# EAGLE board A500-EXT-IDE.v1.0.0 (EAGLE 9.0.0)
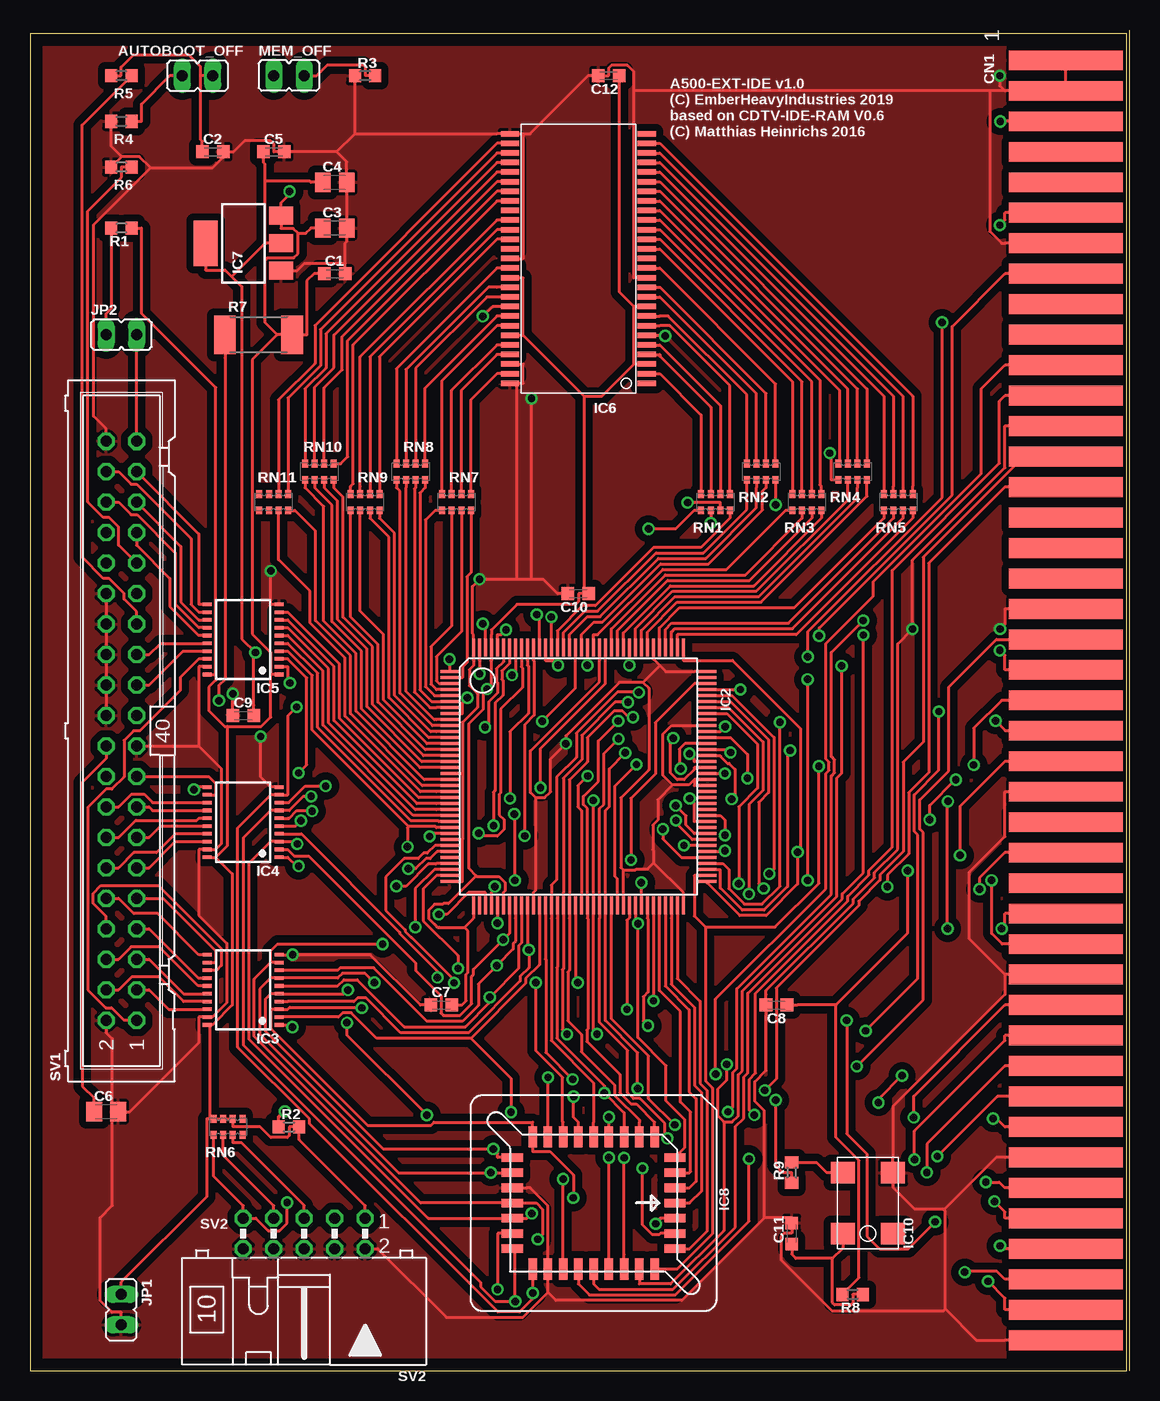
[diagram p2: board, top side]
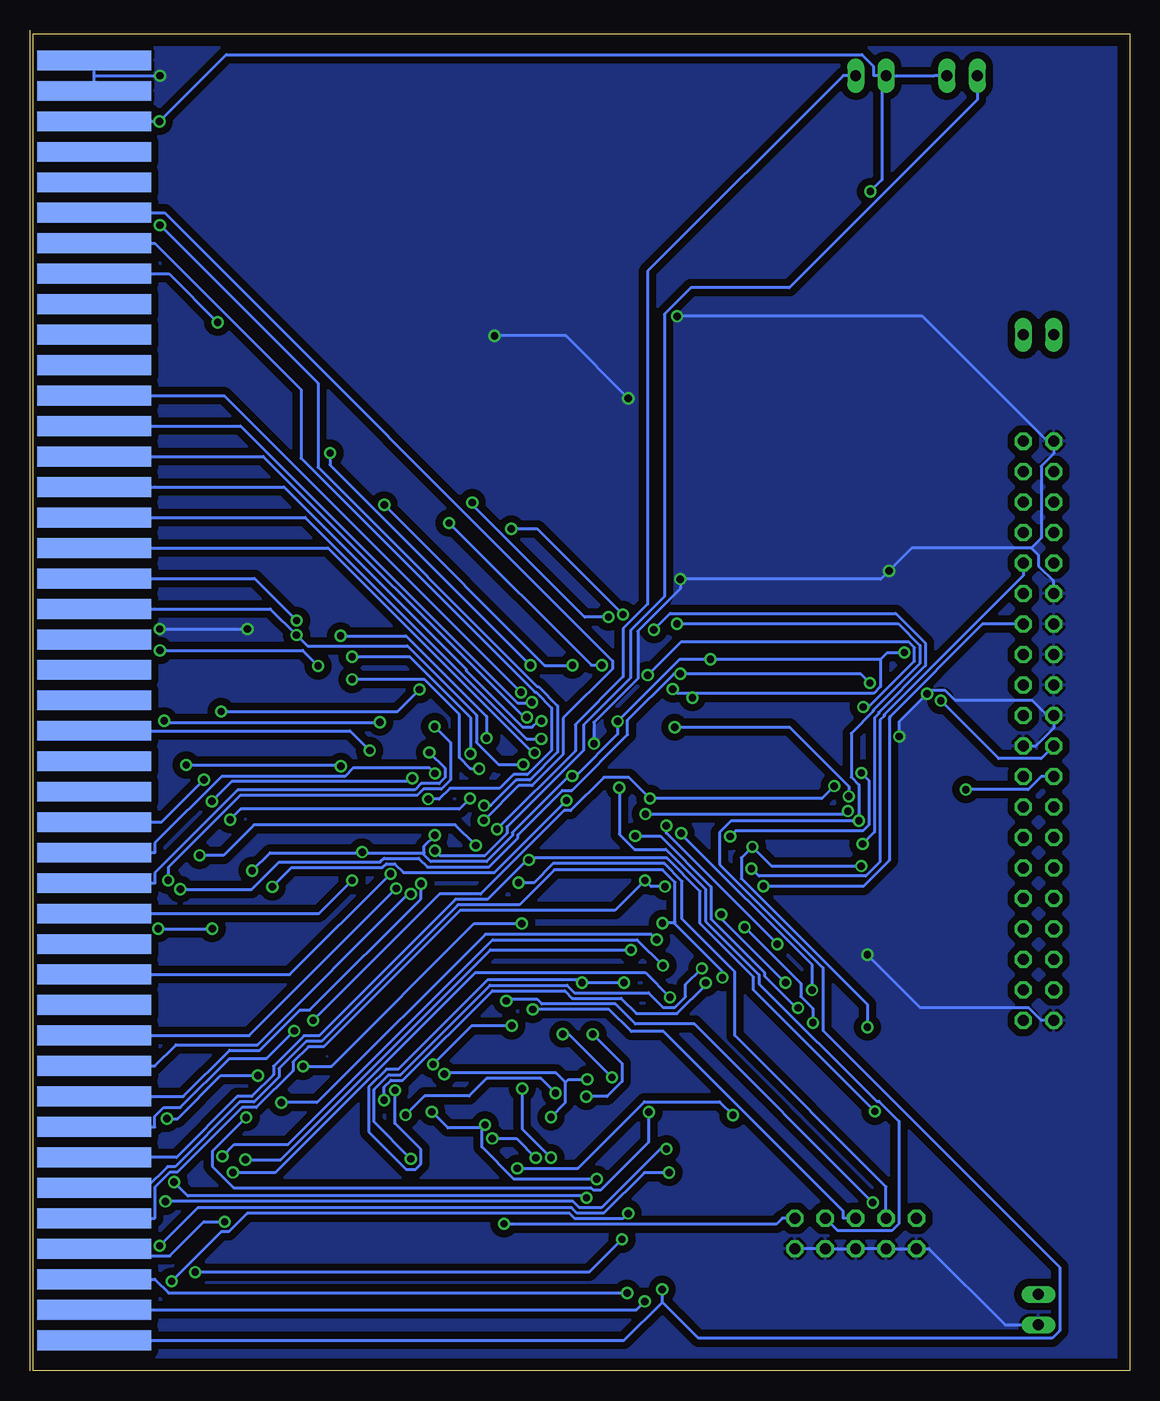
[diagram p3: board, bottom side, seen from below]

Size 91.42 x 111.43 mm. Coordinates in mm from the lower left corner, seen from the top.
Outline: 0,0 91.42,0 91.42,111.43 0,111.43 0,0
Copper layers (1*16): Top 0.035mm / dielectric 0.36mm / Bottom 0.035mm
Design rules "default *": minimum track width 10mil, minimum drill 24mil, track to track 8mil, track to pad 8mil, pad to pad 8mil, via to via 8mil, smd to smd 8mil, copper to edge 40mil, drill to drill 8mil, minimum pad ring 10mil, minimum via ring 8mil, stop-mask expansion 4mil, vias tented up to drill 0mil, thermal gap 10mil

## Footprints (pad centres in the part's own frame; a part is rotated, then mirrored left to right if it is on the bottom)
JP1 = drill 0.914 long: 1 0,-1.27; 2 0,1.27
C0603K = smd 1.05 x 1.08: 1 -0.875,0; 2 0.875,0
C0805K = smd 1.3 x 1.6: 1 -1,0; 2 1,0
LKONT_43-SLOT-SOLDER = smd 1.65 x 9.5: 1 -53.34,5.08; 3 -50.8,5.08; 5 -48.26,5.08; 7 -45.72,5.08; 9 -43.18,5.08; 11 -40.64,5.08; 13 -38.1,5.08; 15 -35.56,5.08; 17 -33.02,5.08; 19 -30.48,5.08; 21 -27.94,5.08; 23 -25.4,5.08; 25 -22.86,5.08; 27 -20.32,5.08; 29 -17.78,5.08; 31 -15.24,5.08; 33 -12.7,5.08; 35 -10.16,5.08; 37 -7.62,5.08; 39 -5.08,5.08; 41 -2.54,5.08; 43 0,5.08; 45 2.54,5.08; 47 5.08,5.08; 49 7.62,5.08; 51 10.16,5.08; 53 12.7,5.08; 55 15.24,5.08; 57 17.78,5.08; 59 20.32,5.08; 61 22.86,5.08; 63 25.4,5.08; 65 27.94,5.08; 67 30.48,5.08; 69 33.02,5.08; 71 35.56,5.08; 73 38.1,5.08; 75 40.64,5.08; 77 43.18,5.08; 79 45.72,5.08; 81 48.26,5.08; 83 50.8,5.08; 85 53.34,5.08 | smd 1.65 x 9.5 bottom: 2 -53.34,5.08; 4 -50.8,5.08; 6 -48.26,5.08; 8 -45.72,5.08; 10 -43.18,5.08; 12 -40.64,5.08; 14 -38.1,5.08; 16 -35.56,5.08; 18 -33.02,5.08; 20 -30.48,5.08; 22 -27.94,5.08; 24 -25.4,5.08; 26 -22.86,5.08; 28 -20.32,5.08; 30 -17.78,5.08; 32 -15.24,5.08; 34 -12.7,5.08; 36 -10.16,5.08; 38 -7.62,5.08; 40 -5.08,5.08; 42 -2.54,5.08; 44 0,5.08; 46 2.54,5.08; 48 5.08,5.08; 50 7.62,5.08; 52 10.16,5.08; 54 12.7,5.08; 56 15.24,5.08; 58 17.78,5.08; 60 20.32,5.08; 62 22.86,5.08; 64 25.4,5.08; 66 27.94,5.08; 68 30.48,5.08; 70 33.02,5.08; 72 35.56,5.08; 74 38.1,5.08; 76 40.64,5.08; 78 43.18,5.08; 80 45.72,5.08; 82 48.26,5.08; 84 50.8,5.08; 86 53.34,5.08
TQFP144 = smd 0.27 x 1.5: 1 -8.75,-10.75; 2 -8.25,-10.75; 3 -7.75,-10.75; 4 -7.25,-10.75; 5 -6.75,-10.75; 6 -6.25,-10.75; 7 -5.75,-10.75; 8 -5.25,-10.75; 9 -4.75,-10.75; 10 -4.25,-10.75; 11 -3.75,-10.75; 12 -3.25,-10.75; 13 -2.75,-10.75; 14 -2.25,-10.75; 15 -1.75,-10.75; 16 -1.25,-10.75; 17 -0.75,-10.75; 18 -0.25,-10.75; 19 0.25,-10.75; 20 0.75,-10.75; 21 1.25,-10.75; 22 1.75,-10.75; 23 2.25,-10.75; 24 2.75,-10.75; 25 3.25,-10.75; 26 3.75,-10.75; 27 4.25,-10.75; 28 4.75,-10.75; 29 5.25,-10.75; 30 5.75,-10.75; 31 6.25,-10.75; 32 6.75,-10.75; 33 7.25,-10.75; 34 7.75,-10.75; 35 8.25,-10.75; 36 8.75,-10.75; 73 8.75,10.75; 74 8.25,10.75; 75 7.75,10.75; 76 7.25,10.75; 77 6.75,10.75; 78 6.25,10.75; 79 5.75,10.75; 80 5.25,10.75; 81 4.75,10.75; 82 4.25,10.75; 83 3.75,10.75; 84 3.25,10.75; 85 2.75,10.75; 86 2.25,10.75; 87 1.75,10.75; 88 1.25,10.75; 89 0.75,10.75; 90 0.25,10.75; 91 -0.25,10.75; 92 -0.75,10.75; 93 -1.25,10.75; 94 -1.75,10.75; 95 -2.25,10.75; 96 -2.75,10.75; 97 -3.25,10.75; 98 -3.75,10.75; 99 -4.25,10.75; 100 -4.75,10.75; 101 -5.25,10.75; 102 -5.75,10.75; 103 -6.25,10.75; 104 -6.75,10.75; 105 -7.25,10.75; 106 -7.75,10.75; 107 -8.25,10.75; 108 -8.75,10.75 | smd 1.5 x 0.27: 37 10.75,-8.75; 38 10.75,-8.25; 39 10.75,-7.75; 40 10.75,-7.25; 41 10.75,-6.75; 42 10.75,-6.25; 43 10.75,-5.75; 44 10.75,-5.25; 45 10.75,-4.75; 46 10.75,-4.25; 47 10.75,-3.75; 48 10.75,-3.25; 49 10.75,-2.75; 50 10.75,-2.25; 51 10.75,-1.75; 52 10.75,-1.25; 53 10.75,-0.75; 54 10.75,-0.25; 55 10.75,0.25; 56 10.75,0.75; 57 10.75,1.25; 58 10.75,1.75; 59 10.75,2.25; 60 10.75,2.75; 61 10.75,3.25; 62 10.75,3.75; 63 10.75,4.25; 64 10.75,4.75; 65 10.75,5.25; 66 10.75,5.75; 67 10.75,6.25; 68 10.75,6.75; 69 10.75,7.25; 70 10.75,7.75; 71 10.75,8.25; 72 10.75,8.75; 109 -10.75,8.75; 110 -10.75,8.25; 111 -10.75,7.75; 112 -10.75,7.25; 113 -10.75,6.75; 114 -10.75,6.25; 115 -10.75,5.75; 116 -10.75,5.25; 117 -10.75,4.75; 118 -10.75,4.25; 119 -10.75,3.75; 120 -10.75,3.25; 121 -10.75,2.75; 122 -10.75,2.25; 123 -10.75,1.75; 124 -10.75,1.25; 125 -10.75,0.75; 126 -10.75,0.25; 127 -10.75,-0.25; 128 -10.75,-0.75; 129 -10.75,-1.25; 130 -10.75,-1.75; 131 -10.75,-2.25; 132 -10.75,-2.75; 133 -10.75,-3.25; 134 -10.75,-3.75; 135 -10.75,-4.25; 136 -10.75,-4.75; 137 -10.75,-5.25; 138 -10.75,-5.75; 139 -10.75,-6.25; 140 -10.75,-6.75; 141 -10.75,-7.25; 142 -10.75,-7.75; 143 -10.75,-8.25; 144 -10.75,-8.75
TSSOP20 = smd 0.3 x 0.75: 1 -2.925,-3; 2 -2.275,-3; 3 -1.625,-3; 4 -0.975,-3; 5 -0.325,-3; 6 0.325,-3; 7 0.975,-3; 8 1.625,-3; 9 2.275,-3; 10 2.925,-3; 11 2.925,3; 12 2.275,3; 13 1.625,3; 14 0.975,3; 15 0.325,3; 16 -0.325,3; 17 -0.975,3; 18 -1.625,3; 19 -2.275,3; 20 -2.925,3
TSOP-2_54 = smd 1.51 x 0.458: P$1 -5.7,10.4; P$2 -5.7,9.6; P$3 -5.7,8.8; P$4 -5.7,8; P$5 -5.7,7.2; P$6 -5.7,6.4; P$7 -5.7,5.6; P$8 -5.7,4.8; P$9 -5.7,4; P$10 -5.7,3.2; P$11 -5.7,2.4; P$12 -5.7,1.6; P$13 -5.7,0.8; P$14 -5.7,0; P$15 -5.7,-0.8; P$16 -5.7,-1.6; P$17 -5.7,-2.4; P$18 -5.7,-3.2; P$19 -5.7,-4; P$20 -5.7,-4.8; P$21 -5.7,-5.6; P$22 -5.7,-6.4; P$23 -5.7,-7.2; P$24 -5.7,-8; P$25 -5.7,-8.8; P$26 -5.7,-9.6; P$27 -5.7,-10.4; P$28 5.7,-10.4; P$29 5.7,-9.6; P$30 5.7,-8.8; P$31 5.7,-8; P$32 5.7,-7.2; P$33 5.7,-6.4; P$34 5.7,-5.6; P$35 5.7,-4.8; P$36 5.7,-4; P$37 5.7,-3.2; P$38 5.7,-2.4; P$39 5.7,-1.6; P$40 5.7,-0.8; P$41 5.7,0; P$42 5.7,0.8; P$43 5.7,1.6; P$44 5.7,2.4; P$45 5.7,3.2; P$46 5.7,4; P$47 5.7,4.8; P$48 5.7,5.6; P$49 5.7,6.4; P$50 5.7,7.2; P$51 5.7,8; P$52 5.7,8.8; P$53 5.7,9.6; P$54 5.7,10.4
SOT223 = smd 1.5 x 2: 1 -2.3,-3.15; 2 0,-3.15; 3 2.3,-3.15 | smd 3.8 x 2: 4 0,3.15
PLCC-32-SMT-TT = smd 0.71 x 1.78: 1 0,6.785; 2 -1.27,6.785; 3 -2.54,6.785; 4 -3.81,6.785; 14 -3.81,-6.785; 15 -2.54,-6.785; 16 -1.27,-6.785; 17 0,-6.785; 18 1.27,-6.785; 19 2.54,-6.785; 20 3.81,-6.785; 30 3.81,6.785; 31 2.54,6.785; 32 1.27,6.785 | smd 1.78 x 0.71: 5 -5.515,5.08; 6 -5.515,3.81; 7 -5.515,2.54; 8 -5.515,1.27; 9 -5.515,0; 10 -5.515,-1.27; 11 -5.515,-2.54; 12 -5.515,-3.81; 13 -5.515,-5.08; 21 5.515,-5.08; 22 5.515,-3.81; 23 5.515,-2.54; 24 5.515,-1.27; 25 5.515,0; 26 5.515,1.27; 27 5.515,2.54; 28 5.515,3.81; 29 5.515,5.08
7X5 = smd 1.8 x 2: P$1 -2.54,-2.1; P$2 2.54,-2.1; P$3 2.54,2.1; P$4 -2.54,2.1
R0603 = smd 1 x 1.1: 1 -0.85,0; 2 0.85,0
R2512 = smd 1.8 x 3.2: 1 -2.8,0; 2 2.8,0
CAY16 = smd 0.5 x 0.65: 1 -1.2,-0.675; 2 -0.4,-0.675; 3 0.4,-0.675; 4 1.2,-0.675; 5 1.2,0.675; 6 0.4,0.675; 7 -0.4,0.675; 8 -1.2,0.675
ML40 = drill 0.914 octagon: 1 -24.13,-1.27; 2 -24.13,1.27; 3 -21.59,-1.27; 4 -21.59,1.27; 5 -19.05,-1.27; 6 -19.05,1.27; 7 -16.51,-1.27; 8 -16.51,1.27; 9 -13.97,-1.27; 10 -13.97,1.27; 11 -11.43,-1.27; 12 -11.43,1.27; 13 -8.89,-1.27; 14 -8.89,1.27; 15 -6.35,-1.27; 16 -6.35,1.27; 17 -3.81,-1.27; 18 -3.81,1.27; 19 -1.27,-1.27; 20 -1.27,1.27; 21 1.27,-1.27; 22 1.27,1.27; 23 3.81,-1.27; 24 3.81,1.27; 25 6.35,-1.27; 26 6.35,1.27; 27 8.89,-1.27; 28 8.89,1.27; 29 11.43,-1.27; 30 11.43,1.27; 31 13.97,-1.27; 32 13.97,1.27; 33 16.51,-1.27; 34 16.51,1.27; 35 19.05,-1.27; 36 19.05,1.27; 37 21.59,-1.27; 38 21.59,1.27; 39 24.13,-1.27; 40 24.13,1.27
ML10L = drill 0.914 octagon: 1 -5.08,-1.27; 2 -5.08,1.27; 3 -2.54,-1.27; 4 -2.54,1.27; 5 0,-1.27; 6 0,1.27; 7 2.54,-1.27; 8 2.54,1.27; 9 5.08,-1.27; 10 5.08,1.27

## Placement (x,y rotation side)
AUTOBOOT_OFF  [JP1]  13.97,107.95 90 top
C1  100n  [C0603K]  25.4,91.44 0 top
C2  100n  [C0603K]  15.24,101.6 0 top
C3  10u  [C0805K]  25.4,95.25 0 top
C4  10u  [C0805K]  25.4,99.06 0 top
C5  100n  [C0603K]  20.32,101.6 0 top
C6  10u  [C0805K]  6.35,21.59 0 top
C7  100n  [C0603K]  34.29,30.48 0 top
C8  100n  [C0603K]  62.23,30.48 180 top
C9  100n  [C0603K]  17.78,54.61 0 top
C10  100n  [C0603K]  45.72,64.77 180 top
C11  100n  [C0603K]  63.5,11.43 90 top
C12  100n  [C0603K]  48.26,107.95 180 top
CN1  A500-EXPANSION-SLOT-SOLDER  [LKONT_43-SLOT-SOLDER]  81.28,55.88 270 top
IC2  XC95288XL-TQ144  [TQFP144]  45.72,49.53 270 top
IC3  74HCT245PW  [TSSOP20]  17.78,31.75 90 top
IC4  74HCT245PW  [TSSOP20]  17.78,45.72 90 top
IC5  74HCT245PW  [TSSOP20]  17.78,60.96 90 top
IC6  AS4C4M16S-6TCN  [TSOP-2_54]  45.72,92.71 180 top
IC7  LD117AS33TR  [SOT223]  17.78,93.98 90 top
IC8  AM29F010J-SOCKET  [PLCC-32-SMT-TT]  46.99,13.97 270 top
IC10  50MHz  [7X5]  69.85,13.97 90 top
JP1  [JP1]  7.62,5.08 180 top
JP2  [JP1]  7.62,86.36 270 top
MEM_OFF  [JP1]  21.59,107.95 270 top
R1  330  [R0603]  7.62,95.25 180 top
R2  4.7k  [R0603]  21.59,20.32 0 top
R3  4.7k  [R0603]  27.94,107.95 0 top
R4  4.7k  [R0603]  7.62,104.14 0 top
R5  4.7k  [R0603]  7.62,107.95 0 top
R6  4.7k  [R0603]  7.62,100.33 0 top
R7  750mA  [R2512]  19.05,86.36 0 top
R8  FERRITE  [R0603]  68.58,6.35 180 top
R9  47  [R0603]  63.5,16.51 90 top
RN1  33  [CAY16]  57.15,72.39 0 top
RN2  33  [CAY16]  60.96,74.93 0 top
RN3  33  [CAY16]  64.77,72.39 0 top
RN4  33  [CAY16]  68.58,74.93 0 top
RN5  33  [CAY16]  72.39,72.39 0 top
RN6  4.7k  [CAY16]  16.51,20.32 0 top
RN7  33  [CAY16]  35.56,72.39 180 top
RN8  33  [CAY16]  31.75,74.93 180 top
RN9  33  [CAY16]  27.94,72.39 180 top
RN10  33  [CAY16]  24.13,74.93 180 top
RN11  33  [CAY16]  20.32,72.39 180 top
SV1  [ML40]  7.62,53.34 90 top
SV2  [ML10L]  22.86,11.43 180 top

## Tracks (layer width: path | path; a pad name or v marks a point on that pad's centre or on a via)
!BERR  (via drill 0.61 pad 1.02)
  Top 0.254: v63.37,51.7 63.16,51.49 63.16,40.36 61.19,38.39 59.39,38.39 57.55,40.23 57.55,41.78 IC2.75
  Bottom 0.254: CN1.46 65.01,53.34 v63.37,51.7
!BGACK  (via drill 0.61 pad 1.02)
  Top 0.254: IC2.104 58.53,56.28 62.03,52.79 62.03,41.81 v61.63,41.42
  Bottom 0.254: CN1.62 70.03,33.02 v61.63,41.42
!C1  (via drill 0.61 pad 1.02)
  Top 0.254: v64.84,59.52 64.84,61.6 76.04,72.8 v76.04,87.38 | IC2.93 55.39,50.78 55.39,51.01 v54.98,51.43
  Bottom 0.254: v64.84,59.52 60.03,59.52 54.98,54.46 v54.98,51.43 | v76.04,87.38 80.1,91.44 81.28,91.44 CN1.16
!C3  (via drill 0.61 pad 1.02)
  Top 0.254: IC2.94 57.55,51.28 57.55,51.21 58.14,50.62 58.28,50.62 58.78,50.12 58.78,47.93 v58.5,47.65
  Bottom 0.254: v58.5,47.65 57.59,47.65 56.69,48.54 52.55,48.54 51.4,49.69 50.22,49.69 48.2,51.71 48.2,55.26 49.5,56.56 49.59,56.56 69.1,76.07 69.1,81.8 81.28,93.98 CN1.14
!CAS
  Top 0.254: IC2.120 48.97,61.69 53.16,65.88 59.99,65.88 65.17,71.06 RN3.3
!CFIN  (via drill 0.61 pad 1.02)
  Top 0.254: IC2.80 55.23,44.28 53.86,45.65 v53.86,45.87
  Bottom 0.254: CN1.12 80.48,96.52 43.13,59.17 43.13,58.5 47.24,54.39 47.24,51.37 49.84,48.78 50.95,48.78 v53.86,45.87
!CFOUT  (via drill 0.61 pad 1.02)
  Top 0.254: v53.83,47.1 54.7,46.24 54.7,45.47 55.39,44.78 IC2.81 | CN1.11 81.28,96.52 81.28,95.91 v80.86,95.48
  Bottom 0.254: v80.86,95.48 67.69,82.32 67.69,75.31 49.41,57.02 49.31,57.02 47.7,55.41 47.7,51.56 50.03,49.23 51.15,49.23 53.28,47.1 v53.83,47.1
!DTACK  (via drill 0.61 pad 1.02)
  Top 0.254: v61.16,40.2 60.76,40.6 60.76,47.38 61.57,48.19 61.57,52.6 58.39,55.78 57.55,55.78 IC2.103
  Bottom 0.254: v61.16,40.2 73.42,27.94 81.28,27.94 CN1.66
!IDE_ACT
  Top 0.254: SV1.39 JP2.2
!IDE_R
  Top 0.254: SV1.25 9.93,59.69 10.88,60.63 IC5.16
!IDE_W
  Top 0.254: SV1.23 9.93,57.15 12.77,59.98 IC5.17
!LDS  (via drill 0.61 pad 1.02)
  Top 0.254: IC2.101 58.09,54.78 60.66,52.22 60.66,48.57 59.09,47 v59.09,40.6
  Bottom 0.254: CN1.70 78.91,22.86 75.07,26.71 72.54,26.71 69.19,30.05 | 69.19,30.05 | 69.19,30.05 68.37,30.05 59.09,39.33 v59.09,40.6
!MEM_CS  (via drill 0.61 pad 1.02)
  Top 0.254: v49.97,58.8 IC2.118 | v66.67,76.49 66.8,76.36 66.8,74.25 RN4.1
  Bottom 0.254: v66.67,76.49 66.67,75.5 v49.97,58.8
!MEM_WE
  Top 0.254: IC2.121 48.47,61.84 52.97,66.34 59.65,66.34 64.37,71.06 RN3.2
!RAS
  Top 0.254: IC2.119 49.47,61.51 53.39,65.43 60.34,65.43 65.97,71.06 RN3.4
!RESET  (via drill 0.61 pad 1.02)
  Top 0.254: v37.48,58.09 v37.47,58.09 37.47,59.2 IC2.143 | v79.16,40.13 79.16,41.06 81.28,43.18 CN1.53 | v21.67,57.32 21.48,57.51 21.48,58.69 IC5.2
  Bottom 0.254: v79.16,40.13 73.2,40.13 70.94,42.39 62.49,42.39 62.17,42.71 59.3,42.71 58.56,41.98 53.44,41.98 51.01,44.41 51.01,44.67 47.32,48.37 46.52,48.37 41.87,53.02 41.87,54.24 38.02,58.09 v37.48,58.09 22.44,58.09 v21.67,57.32
!UDS  (via drill 0.61 pad 1.02)
  Top 0.254: v69.67,28.33 74.02,32.68 74.02,44.66 73.71,44.96 73.71,48 75.76,50.05 v75.76,54.94 | IC2.105 v59.23,56.78
  Bottom 0.254: v69.67,28.33 71.97,26.02 75.07,26.02 79.15,21.93 80.55,21.93 81.28,21.2 81.28,20.32 CN1.72 | v75.76,54.94 61.06,54.94 v59.23,56.78
+3V3  (via drill 0.61 pad 1.02)
  Top 0.254: IC2.109 54.47,59.2 58.56,59.2 64.24,53.52 64.24,43.48 v64,43.23 64,40.55 61.38,37.94 59.19,37.94 56.47,40.65 IC2.73 | 67.19,30.48 73.18,36.47 v73.18,41.68 | R8.2 69.12,7.74 69.12,17.51 67.19,19.44 67.19,30.48 | 67.19,30.48 63.96,30.48 C8.1 | v57.94,44.63 57.94,45.89 57.55,46.28 IC2.84 | v46.49,49.58 45.67,48.76 45.67,46.99 45.97,46.7 IC2.55 | 37.2,41.26 34.88,38.94 34.47,38.94 34.41,38.88 33.73,38.88 33.23,38.38 33.23,37.69 33.73,37.2 33.76,37.2 33.99,36.97 34.12,36.97 34.14,36.94 36.21,36.94 | IC2.42 39.47,39.86 39.59,39.98 39.59,40.7 39.1,41.19 37.26,41.19 37.2,41.26 | 36.21,36.94 36.52,36.64 36.52,33.19 36.37,33.04 36.37,30.83 36.02,30.48 C7.2 | 37.2,41.26 36.57,41.89 36.57,53.91 37.77,55.11 37.77,56.48 v38.1,56.81 38.44,57.15 38.44,59.16 38.47,59.2 IC2.141 38.47,60.82 38.47,61.36 38.47,61.76 40.59,63.88 45.49,63.88 45.74,64.13 45.74,64.77 46.17,64.77 | 46.17,81.25 46.17,64.77 | 41.1,86.31 46.17,81.25 | 46.17,81.25 47.67,81.25 50.34,83.91 | 41.1,86.31 40.99,86.31 IC6.P$49 | IC6.P$43 41.1,91.11 41.1,86.31 | 50.34,83.91 50.34,88.71 | 50.34,83.91 50.45,83.91 IC6.P$3 | C10.1 46.17,64.77 | v42.7,54.12 45.47,56.89 IC2.127 | 50.34,88.71 49.13,89.91 C12.1 | v36.46,56.09 36.05,55.68 36.05,54.78 IC2.8 | 36.21,36.94 36.97,37.7 IC2.37 | v34.97,59.3 IC2.1 | 16.82,91.2 17.65,90.37 17.65,61.01 v18.8,59.86 18.66,59.72 18.66,55.48 C9.2 | 19.6,99.16 19.6,100.58 19.45,100.73 C5.1 | 19.6,93.98 19.6,99.16 | 19.6,99.16 23.32,99.16 23.42,99.06 C4.1 | 16.82,91.2 16.27,91.75 14.63,91.75 IC7.4 | 16.82,91.2 19.6,93.98 | 19.6,93.98 19.71,93.98 IC7.2 | IC6.P$9 50.34,88.71
  Bottom 0.254: 58.82,43.17 58.82,43.76 v57.94,44.63 | 58.82,43.17 58.82,42.98 58.28,42.44 53.63,42.44 51.47,44.6 51.47,44.86 46.75,49.58 v46.49,49.58 46.18,49.58 42.7,53.06 v42.7,54.12 37.53,59.3 v34.97,59.3 20.79,59.3 | 64,43.17 58.82,43.17 | v73.18,41.68 71.69,43.17 64,43.17 | 64,43.17 v64,43.23 | 36.46,56.46 37.75,56.46 v38.1,56.81 | 36.46,56.46 v36.46,56.09 | 20.79,59.3 20.79,57.02 21.34,56.46 36.46,56.46 | 20.79,59.3 20.23,59.86 v18.8,59.86
+5V  (via drill 0.61 pad 1.02)
  Top 0.254: 16.44,53.7 16.22,53.7 14.91,55.01 14.91,56.98 15.48,57.55 15.48,58.03 15.37,58.03 | SV2.1 27.94,13.74 22.44,19.24 R2.2 21.61,20.32 21.61,19.59 21.46,19.44 20.07,19.44 19.17,20.34 16.91,20.34 16.91,20.67 | 22.35,94.81 21.96,95.2 20.93,95.2 IC7.3 20.93,97.36 21.63,98.06 v21.63,98.3 | 20.62,86.36 19.6,87.38 19.6,92.59 19.78,92.77 21.99,92.77 22.35,93.12 22.35,94.81 | 22.35,94.81 22.98,94.81 23.42,95.25 C3.1 | 15.48,42.8 16.87,41.41 16.87,30.47 15.22,28.82 15.02,28.82 | 20.62,86.36 18.54,84.28 18.54,61.41 20.07,59.87 20.07,58.03 | IC5.1 20.07,58.03 | 16.44,53.7 19.29,53.7 20.07,54.49 20.07,58.03 | 16.44,53.7 16.44,43.75 15.48,42.8 | 16.91,20.67 16.69,20.89 16.69,21 RN6.7 RN6.8 15.16,21 15.02,21 | RN6.6 16.91,20.67 | 15.02,21 15.02,28.82 | IC4.20 15.48,42.8 | IC3.20 15.02,28.82 | 15.02,21 14.73,21 14.73,14.5 7.62,7.39 JP1.1 | R5.1 7.6,107.95 7.6,108.68 8.63,109.71 13.22,109.71 14.2,108.73 14.2,107.95 | C2.1 14.37,102.47 14.2,102.64 14.2,107.95 | IC8.32 52.55,12.7 52.55,12.63 v52.17,12.24 | 15.37,58.03 15.48,58.15 15.48,81.95 9.3,88.13 9.3,95.25 R1.1 | IC5.20 15.37,58.03 | C1.1 23.67,91.44 23.08,90.85 23.08,86.36 R7.2 20.62,86.36 | v80.9,104.14 81.28,104.14 CN1.6 | AUTOBOOT_OFF.1 14.2,107.95
  Bottom 0.254: v52.17,12.24 52.13,12.2 29.48,12.2 28.98,12.7 SV2.1 | 20.66,107.95 20.66,99.28 v21.63,98.3 | 20.66,107.95 21.36,107.95 21.36,108.73 22.34,109.71 75.33,109.71 v80.9,104.14 CN1.6 | 20.66,107.95 MEM_OFF.1 16.28,107.95 AUTOBOOT_OFF.1
A1  (via drill 0.61 pad 1.02)
  Top 0.254: v71.49,40.33 71.49,41.31 73.26,43.08 73.26,48.19 74.93,49.86 74.93,67.31 81.28,73.66 CN1.29 | IC8.12 v43.18,24.45 | v47.27,28.06 46.97,28.36 IC2.57 v46.97,47.53
  Bottom 0.254: v71.49,40.33 69.89,41.93 62.3,41.93 61.98,42.26 61.29,42.26 60.56,41.53 52.97,41.53 v46.97,47.53 | v47.27,28.06 46.79,28.06 v43.18,24.45
A2  (via drill 0.61 pad 1.02)
  Top 0.254: CN1.27 82.85,76.2 74.47,67.82 74.47,52.39 72.8,50.72 72.8,43.27 70.87,41.33 70.87,40.9 69.09,39.12 69.09,38.77 62.21,31.89 62.21,24.32 v61.26,23.36 | IC2.54 45.47,32.55 v45.67,32.34 | v42.17,32.34 42.17,26.66 44.4,24.43 44.4,20.75 44.45,20.7 IC8.11
  Bottom 0.254: v61.26,23.36 61.26,20.6 59.11,18.45 59.11,17.24 59.57,16.78 60.33,16.78 63.46,19.91 63.46,23.64 61.98,25.12 60.99,25.12 53.53,32.58 45.91,32.58 v45.67,32.34 v42.18,32.34 v42.17,32.34
A3  (via drill 0.61 pad 1.02)
  Top 0.254: v49.85,55.73 48.78,55.73 46.02,52.96 46.02,50.94 44.47,49.39 44.47,39.86 IC2.52 44.47,33.5 44.38,33.41 44.38,28.43 v44.77,28.04 | IC8.10 45.72,20.7 45.32,21.1 v45.32,22.85
  Bottom 0.254: CN1.26 74.14,78.74 51.07,55.66 49.91,55.66 v49.85,55.73 | v44.77,28.04 42.33,25.6 42.33,24.1 43.58,22.85 v45.32,22.85
A4  (via drill 0.61 pad 1.02)
  Top 0.254: v50.76,56.54 50.74,56.56 48.97,56.56 45.56,53.15 45.56,51.12 43.92,49.48 43.92,40.92 43.47,40.47 IC2.50 43.47,38.35 43.47,37.7 43.46,37.69 43.46,27.52 46.99,23.99 46.99,20.7 | 46.99,20.7 | IC8.9 46.99,20.7
  Bottom 0.254: CN1.24 75.5,81.28 v50.76,56.54
A5  (via drill 0.61 pad 1.02)
  Top 0.254: v57.16,24.71 57.16,30.99 66.35,40.17 66.35,49.77 66.62,50.04 66.62,50.74 66.35,51.01 66.35,60.6 70.3,64.55 70.3,65.76 79.31,74.77 79.31,81.85 81.28,83.82 CN1.21 | IC2.49 42.97,34.3 43.01,34.26 43.01,26.52 v45.24,24.28 | IC8.8 v48.26,21.13
  Bottom 0.254: 47.05,24.02 47.85,24.81 57.06,24.81 v57.16,24.71 | 47.05,24.02 46.78,24.28 v45.24,24.28 | v48.26,21.13 47.05,22.34 47.05,24.02
A6  (via drill 0.61 pad 1.02)
  Top 0.254: v60.38,21.31 59.96,21.73 59.96,24.28 60.49,24.8 60.49,31.46 68.17,39.15 68.17,39.55 69.95,41.33 69.95,41.71 71.88,43.64 71.88,66.7 80.82,75.64 80.82,80.82 81.28,81.28 CN1.23 | IC8.7 49.53,21.5 v47.89,23.14 47.89,23.74 43.92,27.7 43.92,33.6 43.97,33.64 43.97,37.7 43.97,38.35 IC2.51
  Bottom 0.254: v47.89,23.14 49.1,24.36 53.62,24.36 55.08,22.9 58.8,22.9 v60.38,21.31
A7  (via drill 0.61 pad 1.02)
  Top 0.254: v50.27,54.48 49.92,54.48 49.4,55 48.7,55 46.47,52.77 46.47,50.75 44.97,49.24 IC2.53 44.97,37.7 44.97,33.35 44.84,33.22 44.84,29.16 45.98,28.02 45.98,26.58 48.73,23.83 48.73,22.97 50.8,20.89 | 50.8,20.89 | 50.8,20.89 50.8,20.7 IC8.6
  Bottom 0.254: CN1.28 72.25,76.2 50.52,54.48 v50.27,54.48
A8  (via drill 0.61 pad 1.02)
  Top 0.254: v49.05,54.16 47.38,52.49 47.38,49.12 46.13,47.88 46.13,47.18 46.47,46.84 IC2.56 46.47,37.7 46.51,37.66 46.51,28.48 46.43,28.4 46.43,27.44 49.18,24.69 49.18,23.16 50.12,22.22 50.55,22.22 52.07,20.7 IC8.5
  Bottom 0.254: 81.28,73.66 | 81.28,73.66 70.52,73.66 55.34,58.47 55.34,58.36 50.61,53.64 49.82,53.64 49.3,54.16 v49.05,54.16 | CN1.30 81.28,73.66
A9  (via drill 0.61 pad 1.02)
  Top 0.254: v49.06,52.67 47.84,51.44 47.84,47.21 47.47,46.84 IC2.58 47.47,37.7 47.47,29.04 49.82,26.7 49.82,23.17 50.31,22.68 50.84,22.68 52.92,20.6 52.92,19.59 v53.15,19.36 | v49.53,17.74 49.53,9.68 IC8.27
  Bottom 0.254: CN1.32 68.74,71.12 50.29,52.67 v49.06,52.67 | v53.15,19.36 51.14,19.36 v49.53,17.74
A10  (via drill 0.61 pad 1.02)
  Top 0.254: v49.62,51.5 48.29,50.17 48.29,47.02 47.97,46.7 IC2.59 47.97,29.19 50.65,26.5 v50.65,23.52 | v48.26,17.75 48.26,9.68 IC8.26
  Bottom 0.254: CN1.34 66.85,68.58 49.77,51.5 v49.62,51.5 | v50.65,23.52 | v50.65,23.52 50.65,20.15 v48.26,17.75
A11  (via drill 0.61 pad 1.02)
  Top 0.254: v58.19,21.57 58.59,21.97 58.59,24.85 58.93,25.19 58.93,31.84 66.8,39.71 66.8,49.58 67.07,49.85 67.07,50.93 66.8,51.2 66.8,59.87 v69.47,62.54 | v53.76,20.49 51.58,22.66 51.58,26.22 48.47,29.34 IC2.60 | IC8.23 v44.45,15.96
  Bottom 0.254: v44.45,15.96 51.35,15.96 54.02,18.64 54.02,20.22 | CN1.36 72.97,66.04 v69.47,62.54 | 54.02,20.22 v53.76,20.49 | 54.02,20.22 56.85,20.22 v58.19,21.57
A12  (via drill 0.61 pad 1.02)
  Top 0.254: IC2.61 48.97,41.01 48.79,41.19 48.79,48.76 v50.56,50.53 | v69.48,61.32 69.48,41.5 67.72,39.74 67.72,39.34 59.84,31.46 59.84,24.81 59.51,24.47 59.51,21.05 58.8,20.35 58.8,11.97 53.6,6.77 47.46,6.77 46.99,7.24 IC8.25
  Bottom 0.254: v50.56,50.53 52.62,50.53 54.47,52.38 54.47,54.65 60.22,60.41 68.57,60.41 v69.48,61.32 71.66,63.5 81.28,63.5 CN1.38
A13  (via drill 0.61 pad 1.02)
  Top 0.254: v68.93,25.37 74.47,30.92 74.47,44.84 74.17,45.15 74.17,47.58 76.6,50.01 76.6,56.99 80.58,60.96 CN1.39 | IC2.64 50.47,37.48 v50.69,37.27 v50.68,37.26 50.68,27.77 53.04,25.41 53.04,22.47 54.6,20.91 54.6,18.6 IC8.4
  Bottom 0.254: v68.93,25.37 66.56,25.37 54.66,37.27 v50.69,37.27
A14  (via drill 0.61 pad 1.02)
  Top 0.254: 57.84,20.73 58.54,20.73 59.05,21.24 59.05,24.66 59.39,25 59.39,31.65 67.26,39.52 67.26,49.39 67.67,49.8 v67.67,58.75 | 57.84,20.73 57.35,21.22 57.35,23.48 58.09,24.22 v58.09,25.54 | IC2.66 51.47,37.7 51.53,37.64 51.53,31.56 51.14,31.17 51.14,29.14 v51.53,28.75 | 57.84,20.73 57.84,11.67 53.41,7.24 50.8,7.24 IC8.28 | v80.86,60.04 81.28,59.62 81.28,58.42 CN1.41
  Bottom 0.254: v80.86,60.04 68.96,60.04 v67.67,58.75 | v51.53,28.75 54.88,28.75 v58.09,25.54
A15  (via drill 0.61 pad 1.02)
  Top 0.254: 56.32,36.97 62.12,36.97 65.78,40.63 v65.78,50.39 | 56.32,36.97 56.32,24.14 56.9,23.57 56.9,11.4 53.95,8.46 IC8.29 | 56.32,36.97 55.39,37.9 55.39,41.28 IC2.74 | v78.68,50.49 78.68,53.56 81,55.88 81.28,55.88 CN1.43
  Bottom 0.254: v78.68,50.49 65.88,50.49 v65.78,50.39
A16  (via drill 0.61 pad 1.02)
  Top 0.254: IC2.76 57.76,42.28 58.25,41.79 58.25,40.19 59.55,38.89 61.04,38.89 62.52,40.38 v62.52,54.05 | v80.51,54.18 81.28,53.41 81.28,53.34 CN1.45
  Bottom 0.254: v80.51,54.18 80.37,54.05 v62.52,54.05
A17  (via drill 0.61 pad 1.02)
  Top 0.254: IC2.79 v54.52,43.78 | CN1.47 81.28,50.8 77.55,47.07 v77.55,42.95
  Bottom 0.254: v54.52,43.78 56.24,45.49 73.03,45.49 75.56,42.95 v77.55,42.95
A18  (via drill 0.61 pad 1.02)
  Top 0.254: v75.01,45.93 75.01,47.12 77.15,49.26 v77.19,49.26 | IC2.83 55.39,45.78 55.39,47.32 v55.01,47.7
  Bottom 0.254: CN1.52 80.73,45.72 v77.19,49.26 | v55.01,47.7 55.9,46.81 74.13,46.81 v75.01,45.93
A19  (via drill 0.61 pad 1.02)
  Top 0.254: v57.93,49.78 57.55,49.78 IC2.91
  Bottom 0.254: v57.93,49.78 58.37,50.22 64.76,50.22 65.43,49.55 75.7,49.55 81.28,43.97 81.28,43.18 CN1.54
A20  (via drill 0.61 pad 1.02)
  Top 0.254: IC2.95 58.16,51.78 v58.4,51.54
  Bottom 0.254: v58.4,51.54 57.09,50.23 57.09,49.43 57.58,48.94 59.07,48.94 59.6,48.41 74.36,48.41 81.28,41.49 81.28,40.64 CN1.56
A21  (via drill 0.61 pad 1.02)
  Top 0.254: v64.83,40.87 v64.83,57.62 | IC2.96 54.6,52.28 54.12,51.8 54.12,50.3 v54.25,50.17
  Bottom 0.254: CN1.58 67.61,38.1 v64.83,40.87 | v54.25,50.17 54.97,50.17 55.89,51.09 55.89,54.69 58.82,57.62 v64.83,57.62
A22  (via drill 0.61 pad 1.02)
  Top 0.254: IC2.97 58.4,52.78 59.82,51.37 v59.82,49.38 | v76.5,36.84 76.5,47.42 v76.53,47.46 | v81.01,36.84 81.28,37.11 81.28,38.1 CN1.57
  Bottom 0.254: v59.82,49.38 60.1,49.09 74.9,49.09 v76.53,47.46 | v81.01,36.84 v76.5,36.84
A23  (via drill 0.61 pad 1.02)
  Top 0.254: CN1.59 81.05,35.56 80.17,36.44 v80.17,40.88 | IC2.98 57.55,53.28 v57.96,53.69
  Bottom 0.254: v57.96,53.69 56.63,52.36 56.63,49.25 57.4,48.48 58.88,48.48 59.42,47.95 74.17,47.95 80.17,41.95 v80.17,40.88
A_MEM0
  Top 0.254: IC2.113 52.47,61.92 54.15,63.6 63.73,63.6 71.19,71.06 RN5.1
A_MEM1
  Top 0.254: IC2.112 52.97,61.77 53.5,62.3 63.23,62.3 71.99,71.06 RN5.2
A_MEM2
  Top 0.254: IC2.111 53.47,61.58 53.73,61.85 63.58,61.85 72.79,71.06 RN5.3
A_MEM3
  Top 0.254: IC2.110 53.97,61.36 63.89,61.36 73.59,71.06 RN5.4
A_MEM4
  Top 0.254: RN11.7 20.72,67.61 23.35,64.98 23.35,62.33 26.27,59.41 26.27,54.57 32.56,48.28 33.89,48.28 IC2.21
A_MEM5
  Top 0.254: IC2.20 32.7,48.78 26.72,54.76 26.72,59.6 23.81,62.52 23.81,70.01 22.1,71.72 RN11.8
A_MEM6
  Top 0.254: IC2.19 32.87,49.28 27.18,54.97 27.18,59.79 24.49,62.48 24.49,72.04 22.93,73.6 RN10.5
A_MEM7
  Top 0.254: IC2.17 32.52,50.28 27.64,55.16 27.64,59.98 25.18,62.44 25.18,72.15 23.73,73.6 RN10.6
A_MEM8
  Top 0.254: IC2.16 32.66,50.78 28.1,55.35 28.1,60.16 25.64,62.63 25.64,72.5 24.53,73.6 RN10.7
A_MEM9
  Top 0.254: IC2.15 32.81,51.28 28.55,55.54 28.55,60.35 26.09,62.81 26.09,72.84 25.33,73.6 RN10.8
A_MEM10
  Top 0.254: IC2.115 51.47,61.57 53.96,64.05 60.94,64.05 69.78,72.89 RN4.4
A_MEM11
  Top 0.254: IC2.14 32.96,51.78 29.01,55.73 29.01,60.54 26.74,62.81 RN9.5
AS_CPU  (via drill 0.61 pad 1.02)
  Top 0.254: v50.1,42.57 50.1,47.7 52.13,49.72 52.13,54.02 55.39,57.28 IC2.106 | R2.1 20.74,21.2 20.84,21.2 v21.25,21.61
  Bottom 0.254: CN1.74 79.48,17.78 74.4,22.86 73.2,22.86 71.4,24.66 71.4,25.38 68.86,27.92 67.58,27.92 56.22,39.28 53.55,39.28 50.26,42.57 v50.1,42.57 49.93,42.74 38.6,42.74 35.83,39.96 35.83,37.27 31.37,32.82 31.37,31.73 v21.25,21.61
AUTO_BOOT_OFF  (via drill 0.61 pad 1.02)
  Top 0.254: v57.93,43.34 57.61,43.34 57.55,43.28 IC2.78 | AUTOBOOT_OFF.2 11.66,107.95 9.3,105.59 9.3,104.14 R4.2
  Bottom 0.254: AUTOBOOT_OFF.2 12.7,105.96 28.39,90.27 36.59,90.27 38.8,88.06 38.8,64.53 41.62,61.71 41.62,57.75 45.55,53.82 45.55,51.71 51.92,45.33 51.92,44.79 53.79,42.93 57.52,42.93 v57.93,43.34
BA0
  Top 0.254: IC2.117 50.47,61.86 53.58,64.97 60.56,64.97 68.18,72.59 RN4.2
BA1
  Top 0.254: IC2.116 50.97,61.71 53.77,64.51 60.75,64.51 68.98,72.74 68.98,73.6 | 68.98,73.6 | RN4.3 68.98,73.6
C_IDE_A0
  Top 0.254: IC2.24 33.89,46.78 32.12,46.78 24.89,54 24.89,58.53 21.48,61.94 IC5.7
C_IDE_A1
  Top 0.254: IC2.26 34.09,45.78 34.03,45.84 31.77,45.84 23.98,53.62 23.98,58.14 21.48,60.63 IC5.5
C_IDE_A2
  Top 0.254: IC2.25 34.96,46.29 31.96,46.29 24.44,53.81 24.44,58.33 21.48,61.28 IC5.6
C_IDE_CS0
  Top 0.254: IC2.22 32.41,47.78 25.81,54.38 25.81,58.91 21.48,63.23 IC5.9
C_IDE_CS1
  Top 0.254: IC2.23 33.89,47.28 32.27,47.28 25.35,54.19 25.35,58.72 21.48,62.59 IC5.8
C_IDE_R  (via drill 0.61 pad 1.02)
  Top 0.254: 31.56,45.37 23.52,53.41 23.52,57.95 21.48,59.98 IC5.4 | 31.56,45.37 31.47,45.28 v31.47,43.67 | 31.56,45.37 33.8,45.37 33.89,45.28 IC2.27 | v22.39,42.06 22.22,42.06 21.48,42.8 IC4.1 | v21.88,28.64 21.68,28.64 21.48,28.82 IC3.1
  Bottom 0.254: v21.88,28.64 21.88,30.52 32.39,41.03 32.39,42.75 v31.47,43.67 29.87,42.06 v22.39,42.06
C_IDE_W  (via drill 0.61 pad 1.02)
  Top 0.254: v22.39,49.83 23.07,50.5 23.07,57.76 21.49,59.34 IC5.3 | IC2.28 33.57,44.78 v33.32,44.53
  Bottom 0.254: v22.39,49.83 21.75,49.19 21.75,45.5 22.24,45.01 32.84,45.01 v33.32,44.53
CDAC  (via drill 0.61 pad 1.02)
  Top 0.254: v53.63,52.73 53.41,52.51 53.41,49.81 53.94,49.28 54.54,49.28 55.39,50.13 55.39,50.28 IC2.92 | CN1.15 81.28,91.44 76.88,87.04 76.88,72.99 65.8,61.91 v65.8,61.26
  Bottom 0.254: v65.8,61.26 60.34,61.26 53.63,54.54 v53.63,52.73
CKE
  Top 0.254: IC2.13 33.1,52.28 29.47,55.92 29.47,61.38 27.54,63.31 RN9.6
CLK_EXT  (via drill 0.61 pad 1.02)
  Top 0.254: v62.17,22.55 62.17,17.1 62.77,16.49 63.5,16.49 R9.1 | IC2.30 33.75,43.78 33.12,43.15 32.82,43.15 32.36,42.69 31.2,42.69 29.66,41.15 29.66,38.37 31.28,36.75 31.28,36.62 31.77,36.13 31.81,36.13 35.36,32.59 v35.36,32.32
  Bottom 0.254: v62.17,22.55 62.17,23.64 61.6,24.2 60.61,24.2 53.15,31.66 47.11,31.66 46.49,31.04 42.4,31.04 41.14,29.77 37.74,29.77 35.36,32.16 v35.36,32.32 | v35.36,32.32
CLK_MEM
  Top 0.254: IC2.12 33.25,52.78 29.93,56.1 29.93,69.47 28.34,71.06 RN9.7
D0  (via drill 0.61 pad 1.02)
  Top 0.254: v27.66,30.24 27.6,30.3 21.66,30.3 21.48,30.12 IC3.3 20.43,30.12 20.07,30.12 20.07,28.53 28.14,20.46 33.44,20.46 33.68,20.7 41.91,20.7 41.91,20.09 IC8.13 41.91,18.27 43.34,18.27 45.3,16.31 v45.3,14.41 | CN1.75 81.28,15.24 80.81,15.71 v79.68,15.71 | v41.24,44.57 41.24,53.84 42.03,54.64 42.03,59.14 41.97,59.2 IC2.134
  Bottom 0.254: v41.24,44.57 39.14,44.57 34.91,40.34 34.91,37.65 30.45,33.2 30.45,32.89 27.8,30.24 v27.66,30.24 | v45.3,14.41 45.44,14.56 78.53,14.56 v79.68,15.71
D1  (via drill 0.61 pad 1.02)
  Top 0.254: v26.5,31.73 26.19,31.43 IC3.5 20.43,31.43 20.07,31.43 19.62,30.97 19.62,28.3 29.44,18.48 v38.63,18.48 38.98,18.12 38.98,17.78 IC8.14 | IC2.136 40.97,58.66 41.05,58.58 41.05,56.96 39.24,55.14 39.24,48.16 39.12,48.04 39.12,46.34 39.51,45.95 39.51,45.1 38.97,44.55 37.64,44.55 v37.4,44.79 | CN1.77 81.28,12.7 81.28,13.23 v80.41,14.1
  Bottom 0.254: v37.4,44.79 37.4,44.76 26.5,33.85 v26.5,31.73 | v38.63,18.48 39.15,18.48 44.05,13.57 45.89,13.57 46.42,14.1 v80.41,14.1
D2  (via drill 0.61 pad 1.02)
  Top 0.254: v34.07,38.04 34.76,38.04 36.58,39.86 37.97,39.86 IC2.39 | v28.7,32.34 27.93,33.12 26.05,33.12 25.66,32.73 IC3.7 20.54,32.73 20.07,32.73 19.16,31.81 19.16,28.07 30.72,16.51 v38.41,16.51 IC8.15 | v80.88,10.41 81.03,10.41 81.28,10.16 CN1.79 | v80.88,10.41
  Bottom 0.254: v28.7,32.34 34.07,37.71 v34.07,38.04 | v38.41,16.51 40.47,16.51 43.86,13.12 46.08,13.12 46.54,13.58 77.7,13.58 v80.88,10.41
D3  (via drill 0.61 pad 1.02)
  Top 0.254: IC2.138 39.97,58.94 39.35,58.32 39.35,57.63 39.42,57.56 39.42,56.3 38.78,55.66 38.78,48.35 38.64,48.2 v38.64,45.43 | 20.07,34.02 20.07,35 20.63,35.56 v29.39,35.56 | 20.07,34.02 18.7,32.65 18.7,27.84 32.58,13.97 IC8.17 41.42,13.97 42.21,13.97 42.72,13.46 42.72,11.33 v42.34,10.95 | IC3.9 20.07,34.02 | CN1.81 81.28,7.62 80.6,8.3 78.01,8.3 v77.93,8.21
  Bottom 0.254: v29.39,35.56 38.64,44.8 v38.64,45.43 | v42.34,10.95 45.08,8.21 v77.93,8.21
D4  (via drill 0.61 pad 1.02)
  Top 0.254: v39.68,61.76 39.28,61.36 38.97,61.36 IC2.140 | v22.28,43.91 22.09,44.09 IC4.3 20.43,44.09 20.07,44.09 18.25,42.27 18.25,27.66 33.2,12.7 IC8.18 41.42,12.7 v41.83,13.1 | v79.88,7.44 81.28,6.04 81.28,5.08 CN1.83
  Bottom 0.254: v41.83,13.1 42.27,12.66 46.27,12.66 46.71,13.1 73.59,13.1 75.11,11.57 75.75,11.57 v79.88,7.44 | v39.68,61.76 38.32,63.13 19.52,63.13 17.04,60.65 17.04,58.76 20.93,54.87 20.93,54.78 21.29,54.42 21.29,44.9 v22.28,43.91
D5  (via drill 0.61 pad 1.02)
  Top 0.254: v38.98,6.77 38.98,11.43 IC8.19 | IC2.142 37.97,62.05 v37.75,62.27 | IC4.5 22.14,45.4 v22.59,45.84
  Bottom 0.254: 38.98,5.71 35.98,2.71 6.47,2.71 5.85,3.33 5.85,8.62 25.59,28.36 25.59,33.58 34.21,42.21 34.21,44.86 33.26,45.81 22.62,45.81 v22.59,45.84 22.59,48.84 23.23,49.48 23.23,53.13 21.39,54.97 21.39,55.06 17.5,58.95 17.5,60.46 19.3,62.27 v37.75,62.27 | 38.98,5.71 v38.98,6.77 | CN1.86 42.16,2.54 38.98,5.71
D6  (via drill 0.61 pad 1.02)
  Top 0.254: IC2.139 39.47,59.09 38.89,58.51 38.89,57.44 38.96,57.37 38.96,56.49 38.23,55.76 38.23,53.94 v37.94,53.64 | IC8.20 40.45,9.91 v40.45,5.77 38.79,5.77 37.56,6.99 37.56,7.36 17.79,27.14 17.79,44.41 20.07,46.7 20.43,46.7 IC4.7 21.61,46.7 22.79,47.88 v23.43,47.88
  Bottom 0.254: CN1.84 41.14,5.08 v40.45,5.77 | v37.94,53.64 28.37,53.64 23.43,48.71 v23.43,47.88
D7  (via drill 0.61 pad 1.02)
  Top 0.254: IC2.137 40.47,58.26 v40.19,57.98 | IC8.21 v41.91,6.47 41.91,5.98 40.83,4.89 39,4.89 23.31,20.59 23.31,20.97 17.33,26.95 17.33,45.25 20.07,47.99 IC4.9 21.48,47.99 21.48,54.58 v22.23,55.32
  Bottom 0.254: v22.23,55.32 21.78,55.32 17.96,59.14 17.96,60.27 18.43,60.75 37.42,60.75 v40.19,57.98 | CN1.82 81.28,7.62 80.13,6.47 v41.91,6.47
D8  (via drill 0.61 pad 1.02)
  Top 0.254: v68.09,29.19 68.09,19.75 69.77,18.07 69.77,11.21 70.82,10.17 73.22,10.17 v75.46,12.41 | v40.01,47.69 40.01,53.26 41.54,54.8 41.54,58.74 41.47,58.81 41.47,59.2 IC2.135 | IC4.8 21.57,47.34 22.96,48.73 v24.64,48.73
  Bottom 0.254: v68.09,29.19 57.54,39.74 54.11,39.74 47.16,46.69 46.62,46.69 43.86,49.45 41.77,49.45 v40.01,47.69 25.68,47.69 v24.64,48.73 | CN1.80 85.77,9.57 80.04,9.57 77.2,12.41 v75.46,12.41
D9  (via drill 0.61 pad 1.02)
  Top 0.254: v40.38,46.39 40.38,40.92 v40.43,40.87 | v38.75,40.35 38.75,40.14 38.47,39.86 IC2.40 | 21.6,46.05 21.48,46.05 IC4.6 | 21.6,46.05 | 21.6,46.05 22.24,46.68 23.48,46.68 v23.51,46.65
  Bottom 0.254: v38.75,40.35 39.91,40.35 v40.43,40.87 42.93,38.37 55.84,38.37 67.2,27.01 68.48,27.01 69.76,25.72 69.76,25 72.82,21.94 74.03,21.94 79.42,16.55 80.03,16.55 81.28,15.3 81.28,12.7 CN1.78 | v40.38,46.39 23.77,46.39 v23.51,46.65
D10  (via drill 0.61 pad 1.02)
  Top 0.254: IC4.4 22.63,44.74 30.83,36.55 30.83,36.43 33.97,33.29 v33.97,32.77 | IC2.41 v38.97,37.3
  Bottom 0.254: 38.01,37.3 37.91,37.4 37.91,40.7 38.96,41.75 47.97,41.75 50.9,38.82 56.03,38.82 67.39,27.46 68.67,27.46 70.94,25.19 70.94,24.47 73.01,22.4 74.22,22.4 79.61,17.01 80.22,17.01 81.99,15.24 CN1.76 | v33.97,32.77 33.97,33.26 38.01,37.3 | 38.01,37.3 v38.97,37.3
D11  (via drill 0.61 pad 1.02)
  Top 0.254: v72.7,24.6 70.73,22.62 v70.73,22.35 | v80.28,21.01 80.59,21.01 81.28,20.32 CN1.71 | IC2.43 39.97,36.44 v39.45,35.92 36.98,33.45 36.98,33 36.82,32.85 36.82,30.59 35.84,29.61 34.46,29.61 34.27,29.8 34.27,31.23 32.16,33.35 32.16,33.98 23.23,42.91 22.02,42.91 21.48,43.45 IC4.2
  Bottom 0.254: v80.28,21.01 79.38,21.01 75.79,24.6 v72.7,24.6 | v39.45,35.92 39.91,36.38 53.73,36.38 67.77,22.35 v70.73,22.35
D12  (via drill 0.61 pad 1.02)
  Top 0.254: IC2.44 40.47,37.7 40.47,35.8 40.29,35.61 40.29,35.14 v38.92,33.77 37.38,32.23 37.38,30.45 36.06,29.13 33.1,29.13 28.66,33.58 25.86,33.58 25.66,33.38 IC3.8 | CN1.69 80.65,22.86 v75.65,17.86
  Bottom 0.254: v75.65,17.86 74.66,18.85 70.19,18.85 53.12,35.92 41.07,35.92 v38.92,33.77
D13  (via drill 0.61 pad 1.02)
  Top 0.254: IC2.45 40.97,35.65 40.74,35.42 40.74,33.53 v38.34,31.12 38.34,30.72 36.29,28.68 31.19,28.68 27.28,32.59 26.17,32.59 25.66,32.08 | IC3.6 25.66,32.08 | 25.66,32.08 | v74.77,16.52 74.77,18.89 81.28,25.4 CN1.67
  Bottom 0.254: v74.77,16.52 71.23,16.52 54.56,33.18 40.4,33.18 v38.34,31.12
D14  (via drill 0.61 pad 1.02)
  Top 0.254: IC2.46 41.47,35.19 v41.58,35.08 41.58,33.59 40.87,32.87 40.87,32.47 36.57,28.17 30.91,28.17 28.01,31.08 27.32,31.08 27.02,30.77 21.48,30.77 IC3.4 | v73.74,17.59 73.74,19.98 81.28,27.52 81.28,27.94 CN1.65
  Bottom 0.254: v73.74,17.59 70.81,17.59 53.32,35.08 v41.58,35.08
D15  (via drill 0.61 pad 1.02)
  Top 0.254: 36.76,27.71 28.9,27.71 26.77,29.84 26.08,29.84 25.71,29.48 IC3.2 | IC2.48 42.47,33.83 41.33,32.69 41.33,32.28 36.76,27.71 | 36.76,27.71 40.1,24.38 v40.1,21.55 | CN1.63 81.28,30.48 73.68,22.88 v73.68,21.11
  Bottom 0.254: v73.68,21.11 76.49,18.29 76.49,17.04 74.71,15.25 44.95,15.25 44.77,15.08 44.09,15.08 40.1,19.07 v40.1,21.55
DQ0  (via drill 0.61 pad 1.02)
  Top 0.254: RN1.1 55.37,71.72 53.83,70.17 v51.57,70.17 | IC2.133 42.47,62.81 v42.25,63.03
  Bottom 0.254: v42.25,63.03 49.39,70.17 v51.57,70.17
DQ1  (via drill 0.61 pad 1.02)
  Top 0.254: v44.01,58.8 43.62,59.2 42.97,59.2 IC2.132 | v56.75,70.66 56.75,71.06 RN1.2
  Bottom 0.254: v56.75,70.66 44.89,58.8 v44.01,58.8
DQ2  (via drill 0.61 pad 1.02)
  Top 0.254: v54.82,72.37 57.55,72.37 RN1.3 | IC2.131 v43.47,62.82
  Bottom 0.254: v43.47,62.82 45.45,62.82 54.82,72.2 v54.82,72.37
DQ3
  Top 0.254: RN1.4 58.35,71.06 55.92,68.63 52,68.63 47.14,63.77 46.06,63.77 43.97,61.68 IC2.130
DQ4
  Top 0.254: IC2.129 44.47,61.53 46.25,63.31 47.33,63.31 52.19,68.17 56.13,68.17 59.76,71.8 RN2.1
DQ5
  Top 0.254: IC2.128 44.97,61.36 46.46,62.85 47.52,62.85 52.38,67.71 56.34,67.71 60.56,71.93 60.56,73.6 RN2.2
DQ6
  Top 0.254: RN2.3 61.36,73.6 61.08,73.31 61.08,71.75 56.58,67.25 52.57,67.25 47.71,62.4 47.01,62.4 45.97,61.36 IC2.126
DQ7  (via drill 0.61 pad 1.02)
  Top 0.254: IC2.125 v46.47,58.8 | RN2.4 v62.16,72.18
  Bottom 0.254: v62.16,72.18 48.78,58.8 v46.47,58.8
DQ8
  Top 0.254: IC2.10 33.54,53.78 30.84,56.48 30.84,73.31 30.55,73.6 RN8.5
DQ9
  Top 0.254: RN8.6 31.35,73.6 31.35,56.62 33.69,54.28 33.89,54.28 IC2.9
DQ10
  Top 0.254: RN8.7 32.15,73.6 32.06,73.51 32.06,56.56 33.34,55.28 33.89,55.28 IC2.7
DQ11
  Top 0.254: IC2.6 33.48,55.78 32.52,56.75 32.52,73.17 32.95,73.6 RN8.8
DQ12
  Top 0.254: IC2.5 33.71,56.28 32.98,57.02 32.98,70.91 33.78,71.72 RN7.5
DQ13
  Top 0.254: RN7.6 35.16,62.09 33.43,60.36 33.43,57.24 33.89,56.78 IC2.4
DQ14
  Top 0.254: RN7.7 35.96,61.59 33.89,59.52 33.89,57.51 34.12,57.28 IC2.3
DQ15
  Top 0.254: RN7.8 36.76,66.52 36.42,66.18 36.42,59.05 36.05,58.67 36.05,57.78 IC2.2
GND  (via drill 0.61 pad 1.02)
  Top 0.254: 51.11,57.38 51.6,56.89 51.6,50.09 49.26,47.75 49.26,41.94 49.47,41.73 | 53.57,48.82 52.77,49.62 52.77,53.06 53.49,53.78 IC2.99 | 55.54,49.28 55.97,49.28 IC2.90 | 55.54,49.28 55.39,49.13 55.39,48.78 IC2.89 | 55.54,49.28 55.39,49.28 54.93,48.82 53.57,48.82 | 41.81,65.98 42.78,65.98 43.99,64.77 C10.2 | 40.56,65.98 41.81,65.98 | 41.81,65.98 v41.81,81.05 | IC6.P$6 52.91,86.31 v52.96,86.26 | IC6.P$46 38.56,88.71 v37.75,87.89 | 53.57,48.82 52.33,47.58 52.33,45.9 51.92,45.49 51.92,43.43 52,43.35 52,42.33 | 52,42.33 | 61.22,12.73 61.22,21.66 60.42,22.46 60.42,24.09 61.35,25.02 61.35,29.61 C8.2 61.35,31.35 61.35,31.68 68.63,38.96 68.63,39.31 70.41,41.09 70.41,41.52 72.34,43.45 72.34,60.59 v73.57,61.82 73.57,67.57 81.28,75.28 81.28,78.74 CN1.25 | 42.15,47.76 42.91,47.76 43.4,48.25 43.4,50.99 v44.68,52.27 44.68,52.92 49.14,57.38 51.11,57.38 | 51.11,57.38 52.51,58.78 | 81.28,33.02 78.32,35.98 78.32,41.57 81.28,44.53 81.28,48.26 | 81.28,48.26 | 61.22,12.73 54.34,5.85 43.85,5.85 43.18,6.52 | 61.22,12.73 63.5,12.73 C11.2 63.5,11.45 62.86,11.45 62.6,11.2 62.6,9.24 66.86,4.99 76.15,4.99 76.3,5.14 | IC2.62 49.47,41.73 | 49.47,41.73 50.45,41.73 50.54,41.82 51.48,41.82 52,42.33 | 76.19,13.43 76.15,13.46 73.77,13.46 71.95,15.28 71.95,15.89 IC10.P$2 71.95,17.74 71.95,22.01 81.28,31.34 81.28,33.02 | 76.3,5.14 76.3,13.31 76.19,13.43 | 76.19,13.43 80.54,17.78 81.28,17.78 CN1.73 | 43.18,6.52 IC8.22 43.18,13.75 41.69,15.24 41.42,15.24 40.7,15.24 IC8.16 | 43.18,6.52 41.09,4.43 34.71,4.43 28.98,10.16 SV2.2 | 52.51,58.78 53,58.28 55.39,58.28 IC2.108 | 52.51,58.78 51.97,59.31 IC2.114 | 42.15,47.76 41.73,48.19 41.73,51.68 47.47,57.42 47.47,59.2 IC2.123
  Top 0.254: 76.3,5.14 78.9,2.54 81.28,2.54 CN1.85 | 42.15,47.76 42.15,40.04 41.97,39.86 IC2.47 | 41.1,103.11 41.69,103.11 46.53,107.95 C12.2 48.24,107.95 48.24,108.59 48.47,108.82 49.8,108.82 50.34,108.28 50.34,106.68 | 41.1,103.11 40.99,103.11 IC6.P$28 39.48,103.11 38.94,103.11 27.09,103.11 | IC6.P$41 41.1,92.71 41.1,103.11 | 40.56,65.98 v37.48,65.98 36.88,65.38 36.88,61.45 36.97,61.36 IC2.144 36.97,59.2 36.97,58.77 36.64,58.44 36.64,57.09 37.3,56.44 37.3,55.29 36.05,54.04 36.05,49.78 | 40.56,82.31 40.56,65.98 | 40.56,82.31 41.1,82.31 41.1,83.91 IC6.P$52 | IC6.P$54 40.56,82.31 | v16.91,56.42 16.91,55.48 C9.1 | 27.09,103.11 R3.1 | 25.58,101.6 27.09,103.11 | 25.58,101.6 C5.2 20.34,101.6 20.34,102.24 20.05,102.53 17.9,102.53 16.97,101.6 16.54,101.6 | 25.58,101.6 26.4,100.78 26.4,100.14 26.4,99.57 C4.2 C3.2 26.4,94.12 26.27,94 26.27,92.31 | v19.22,52.86 19.22,49.5 20.07,48.65 IC4.10 | IC2.36 36.05,40.78 36.05,44.28 | 36.05,49.78 36.05,44.28 | IC2.29 36.05,44.28 | 26.27,92.31 22.89,92.31 22.26,91.68 IC7.1 | C1.2 26.27,92.31 | C7.1 32.56,30.48 28.36,34.67 v21.89,34.67 IC3.10 | v20.07,66.67 20.07,63.88 IC5.10 | 14.07,52.07 15.96,50.19 15.96,43.92 15.48,43.45 IC4.19 14.07,43.45 14.07,37.97 16.41,35.63 16.41,30.66 15.22,29.48 IC3.19 14.43,29.48 14.07,29.48 14.07,27.33 8.33,21.59 C6.2 6.86,21.59 | 14.07,52.07 14.07,58.69 IC5.19 | SV1.19 14.07,52.07 | 7.65,101.21 6.77,102.09 R4.1 | 10.05,100.27 9.12,101.21 7.65,101.21 | 7.65,101.21 R6.1 | 10.05,100.27 15.22,100.27 16.54,101.6 | 10.05,100.27 5.3,95.52 5.3,79.56 6.35,78.51 SV1.40 | JP1.2 7.62,4.85 6.84,4.85 5.85,5.84 5.85,12.76 6.86,13.77 6.86,21.59
  Top 0.254: SV1.2 6.35,28.17 6.86,27.66 6.86,21.59 | v80.88,61.82 81.28,62.22 81.28,63.5 CN1.37 | 52,42.33 54.47,39.86 IC2.72 | 80.01,106.68 80.01,94.98 81,93.98 81.28,93.98 CN1.13 | 80.01,106.68 50.34,106.68 | 81.28,106.68 80.01,106.68 | CN1.49 81.28,48.26 | 50.34,106.68 50.34,91.11 IC6.P$12 | v80.85,107.95 80.85,107.11 81.28,106.68 | CN1.61 81.28,33.02 | C2.2 16.54,101.6 | 81.28,106.68 CN1.4 CN1.2 | IC2.18 36.05,49.78 | SV1.22 SV1.24 SV1.26 SV1.28 SV1.30
  Bottom 0.254: v41.81,81.05 47.02,86.26 v52.96,86.26 | 6.35,76.95 17.3,87.89 v37.75,87.89 | v44.68,52.27 44.68,54.04 41.03,57.7 41.03,61.65 37.48,65.2 v37.48,65.98 20.76,65.98 v20.07,66.67 18.16,68.58 8.22,68.58 | v19.22,52.86 19.22,54.1 v16.91,56.42 16.62,56.71 15.38,56.71 14.56,55.88 8.14,55.88 6.35,54.09 | 6.35,76.95 6.35,76.43 7.39,75.39 7.39,69.41 8.22,68.58 | SV1.40 6.35,76.95 | SV1.2 7.39,29.21 8.43,30.25 17.47,30.25 v21.89,34.67 | 8.22,68.58 7.62,67.98 7.62,67.08 6.35,65.81 SV1.30 | JP1.2 10.39,3.81 16.74,10.16 SV2.10 SV2.8 21.36,10.16 SV2.6 24.36,10.16 SV2.4 SV2.2 | v80.88,61.82 v73.57,61.82 | 6.35,54.09 6.35,53.57 7.85,52.07 8.37,52.07 SV1.19 | SV1.22 6.35,54.09 | 86.36,107.95 v80.85,107.95 | 86.36,107.95 CN1.2 | CN1.4 86.36,107.95
  pour Top (isolate 0.61): 0,111.76 81.28,111.76 81.28,0 0,0
  pour Bottom (isolate 0.61): 0,111.76 81.28,111.76 81.28,0 0,0
IDE_A0
  Top 0.254: SV1.35 12.57,68.71 12.57,64.09 14.07,62.59 IC5.13
IDE_A1
  Top 0.254: IC5.15 14.07,61.28 11.66,63.7 11.66,66.04 8.89,68.81 SV1.33
IDE_A2
  Top 0.254: IC5.14 14.07,61.94 12.11,63.9 12.11,68.16 8.92,71.35 8.43,71.35 7.39,72.39 SV1.36
IDE_CS0
  Top 0.254: IC5.11 14.07,63.88 14.07,69.75 SV1.37
IDE_CS1
  Top 0.254: SV1.38 7.39,74.93 8.43,73.89 8.89,73.89 13.43,69.36 13.43,63.88 14.07,63.23 IC5.12
IDE_IRQ  (via drill 0.61 pad 1.02)
  Top 0.254: IC2.31 33.94,43.28 33.36,42.7 33.01,42.7 32.16,41.85 v31.55,41.85 | R6.2 7.64,100.33 7.64,99.5 4.81,96.67 4.81,72.42 6.12,71.12 6.6,71.12 7.39,70.33 7.39,68.81 SV1.31
  Bottom 0.254: 8.89,66.27 | 8.89,66.27 20.47,54.68 20.47,54.59 20.84,54.23 20.84,42.41 22.02,41.22 30.92,41.22 v31.55,41.85 | SV1.31 8.89,66.27
IDE_RST
  Top 0.254: IC5.18 14.07,59.34 12.53,57.79 12.53,56.72 9.15,53.34 8.64,53.34 7.85,52.55 7.85,49.51 6.83,48.49 6.35,48.49 4.82,46.96 4.82,31.76 6.33,30.25 6.81,30.25 7.85,29.21 SV1.1
IDE_WAIT  (via drill 0.61 pad 1.02)
  Top 0.254: v30.55,40.38 31.35,40.38 33.2,42.24 33.85,42.24 33.89,42.28 IC2.33 | SV1.27 8.89,63.27 7.85,64.31 7.85,64.79 6.6,66.04 6.12,66.04 4.34,67.81 4.34,103.82 R5.2
  Bottom 0.254: SV1.27 12.28,62.23 20.02,54.49 20.02,54.4 20.06,54.36 20.06,42.53 22.21,40.38 v30.55,40.38
IDED0
  Top 0.254: IC4.12 15.48,47.99 15.48,48.96 14.91,49.53 SV1.17
IDED1
  Top 0.254: SV1.15 9.93,46.99 10.23,46.7 IC4.14
IDED2
  Top 0.254: SV1.13 9.93,44.45 10.88,45.4 IC4.16
IDED3
  Top 0.254: SV1.11 9.93,41.91 12.12,44.09 IC4.18
IDED4
  Top 0.254: SV1.9 11.09,39.37 15.48,34.98 15.48,34.02 IC3.12
IDED5
  Top 0.254: SV1.7 9.93,36.83 14.04,32.73 IC3.14
IDED6
  Top 0.254: SV1.5 9.93,34.29 12.8,31.43 IC3.16
IDED7
  Top 0.254: SV1.3 9.93,31.75 11.56,30.12 IC3.18
IDED8
  Top 0.254: SV1.4 7.39,31.75 8.46,32.82 10.76,32.82 12.8,30.77 IC3.17
IDED9
  Top 0.254: SV1.6 7.39,34.29 8.43,35.33 10.78,35.33 14.04,32.08 IC3.15
IDED10
  Top 0.254: SV1.8 6.35,37.87 5.28,38.94 5.28,39.8 5.92,40.43 10.7,40.43 15.94,35.18 15.94,33.77 15.54,33.38 IC3.13
IDED11
  Top 0.254: SV1.10 7.39,39.37 8.66,38.1 10.65,38.1 14.07,34.67 IC3.11
IDED12
  Top 0.254: SV1.12 7.39,41.91 8.66,43.18 10.55,43.18 12.12,44.74 IC4.17
IDED13
  Top 0.254: IC4.15 14.07,46.05 13.9,45.88 8.82,45.88 7.39,44.45 SV1.14
IDED14
  Top 0.254: SV1.16 7.39,46.99 8.47,48.07 9.5,48.07 10.22,47.34 IC4.13
IDED15  (via drill 0.61 pad 1.02)
  Top 0.254: IC4.11 13.88,48.65 v13.67,48.44
  Bottom 0.254: v13.67,48.44 8.48,48.44 7.39,49.53 SV1.18
KEY_PIN_POWER  (via drill 0.61 pad 1.02)
  Top 0.254: v15.75,55.85 15.75,57.13 16.25,57.63 16.25,84.43 R7.1 | C6.1 5.35,22.72 4.37,23.7 4.37,49.05 6.35,51.03 SV1.20
  Bottom 0.254: SV1.20 7.39,51.03 10.93,51.03 v15.75,55.85
LDQM
  Top 0.254: IC2.124 46.97,61.36 47.32,61.36 52.76,66.8 58.07,66.8 62.99,71.72 RN3.1
MEM_OFF  (via drill 0.61 pad 1.02)
  Top 0.254: v52.76,45.14 52.76,44.34 54.32,42.78 IC2.77 | MEM_OFF.2 23.9,107.95 24.78,108.83 27.81,108.83 27.96,108.68 27.96,107.95 R3.2
  Bottom 0.254: MEM_OFF.2 23.9,107.95 40.2,91.65 40.2,63.9 42.24,61.86 42.24,57.86 46.23,53.86 46.23,51.67 v52.76,45.14
N$1
  Top 0.254: RN5.5 73.59,73.72 73.59,81.22 52.51,102.31 IC6.P$26
N$2
  Top 0.254: RN5.6 72.79,81.22 52.51,101.51 IC6.P$25
N$3
  Top 0.254: RN5.7 71.99,73.72 71.99,81.22 52.51,100.71 IC6.P$24
N$4
  Top 0.254: RN5.8 71.19,81.22 52.51,99.91 IC6.P$23
N$5
  Top 0.254: RN4.5 69.78,81.83 52.51,99.11 IC6.P$22
N$6
  Top 0.254: IC6.P$21 52.51,98.31 68.98,81.83 RN4.6
N$7
  Top 0.254: IC6.P$20 52.51,97.51 68.18,81.83 RN4.7
N$8
  Top 0.254: RN4.8 67.51,75.74 67.51,81.7 52.51,96.71 IC6.P$19
N$9
  Top 0.254: RN3.5 65.97,73.72 65.84,73.85 65.84,82.58 52.51,95.91 IC6.P$18
N$10
  Top 0.254: IC6.P$17 52.51,95.11 65.17,82.44 RN3.6
N$11
  Top 0.254: IC6.P$16 52.51,94.31 64.37,82.44 RN3.7
N$12
  Top 0.254: IC6.P$15 52.51,93.51 63.57,82.44 RN3.8
N$13
  Top 0.254: IC6.P$13 52.51,91.91 62.16,82.25 RN2.5
N$14
  Top 0.254: IC6.P$11 52.51,90.31 61.36,81.45 RN2.6
N$15
  Top 0.254: IC6.P$10 52.51,89.51 60.56,81.45 RN2.7
N$16
  Top 0.254: RN2.8 59.76,81.35 53.2,87.91 52.51,87.91 IC6.P$8
N$17
  Top 0.254: RN1.5 58.35,82.11 53.35,87.11 52.51,87.11 IC6.P$7
N$18
  Top 0.254: RN1.6 57.55,80.47 52.51,85.51 IC6.P$5
N$19
  Top 0.254: RN1.7 56.75,80.31 52.51,84.56 52.51,84.71 IC6.P$4
N$20
  Top 0.254: RN1.8 55.95,79.67 52.51,83.11 IC6.P$2
N$21
  Top 0.254: RN7.1 36.76,80.94 38.94,83.11 IC6.P$53
N$22
  Top 0.254: IC6.P$51 38.94,84.71 35.96,81.73 RN7.2
N$23
  Top 0.254: IC6.P$50 38.94,85.51 35.16,81.73 RN7.3
N$24
  Top 0.254: IC6.P$48 38.94,87.11 34.36,82.53 RN7.4
N$25
  Top 0.254: RN8.1 32.95,81.91 38.94,87.9 38.94,87.91 IC6.P$47
N$26
  Top 0.254: RN8.2 32.15,83.57 38.09,89.51 38.94,89.51 IC6.P$45
N$27
  Top 0.254: RN8.3 31.35,83.45 38.21,90.31 38.94,90.31 IC6.P$44
N$28
  Top 0.254: RN8.4 30.55,83.53 38.94,91.91 IC6.P$42
N$29
  Top 0.254: RN9.1 29.14,84.52 38.94,94.31 IC6.P$39
N$30
  Top 0.254: RN9.2 28.34,84.52 38.94,95.11 IC6.P$38
N$31
  Top 0.254: RN9.3 27.54,73.72 27.54,84.52 38.94,95.91 IC6.P$37
N$32
  Top 0.254: RN9.4 26.74,73.72 26.95,73.93 26.95,85.53 38.94,97.51 IC6.P$35
N$33
  Top 0.254: IC6.P$34 38.94,98.31 26.5,85.87 26.5,76.19 25.91,75.61 RN10.1
N$34
  Top 0.254: RN10.2 24.53,81.93 26.04,83.44 26.04,86.22 38.94,99.11 IC6.P$33
N$35
  Top 0.254: IC6.P$32 38.94,99.91 25.35,86.33 25.35,83.63 23.73,82 RN10.3
N$36
  Top 0.254: RN10.4 22.93,81.85 24.67,83.59 24.67,86.44 38.94,100.71 IC6.P$31
N$37
  Top 0.254: RN11.1 21.52,81.09 24.21,83.78 24.21,86.78 38.94,101.51 IC6.P$30
N$38
  Top 0.254: RN11.2 20.72,80.93 23.75,83.97 23.75,87.13 38.94,102.31 IC6.P$29
N$39
  Top 0.254: IC10.P$3 66.42,16.51 65.57,17.36 R9.2
N$42
  Top 0.254: JP2.1 6.35,88.11 6.77,88.53 R1.2
R/W  (via drill 0.61 pad 1.02)
  Top 0.254: IC2.102 58.24,55.28 61.11,52.41 61.11,48.38 59.94,47.21 v59.94,39.73
  Bottom 0.254: 72.73,27.16 79.52,27.16 81.28,25.4 CN1.68 | 72.73,27.16 | 72.73,27.16 60.16,39.73 v59.94,39.73
ROM_B0
  Top 0.254: IC8.3 54.99,16.51 55.06,16.58 55.06,21.56 54.22,22.4 54.22,29.94 52.47,31.7 IC2.68
ROM_B1
  Top 0.254: IC2.69 52.97,32.06 54.95,30.08 54.95,23.25 55.52,22.68 55.52,15.77 54.99,15.24 IC8.2
ROM_B2
  Top 0.254: 53.47,37.7 | 53.47,37.7 53.47,32.21 55.41,30.27 55.41,23.76 55.98,23.19 55.98,14.96 54.99,13.97 IC8.1 | IC2.70 53.47,37.7
ROM_B3
  Top 0.254: IC2.71 53.97,32.68 55.86,30.79 55.86,23.95 56.44,23.38 56.44,11.6 54.99,10.16 IC8.30
ROM_OE  (via drill 0.61 pad 1.02)
  Top 0.254: v35.68,33.54 35.68,34.6 32.78,37.5 32.78,40.17 33.89,41.28 IC2.35 | v59.95,17.66 59.95,12.46 53.79,6.31 46.64,6.31 45.72,7.24 IC8.24
  Bottom 0.254: v59.95,17.66 63.01,20.72 63.01,23.45 61.8,24.66 60.8,24.66 53.34,32.12 46.92,32.12 46.3,31.5 40.13,31.5 38.91,30.28 37.93,30.28 37.04,31.17 37.04,32.18 v35.68,33.54
ROM_WE  (via drill 0.61 pad 1.02)
  Top 0.254: IC2.34 33.71,41.78 32.12,40.19 v32.12,36.97 | v33.09,21.3 26.43,27.97 v26.43,29 | v51.07,16.87 51.07,12.15 51.89,11.33 52.46,11.33 52.55,11.43 IC8.31 | v51.07,16.87
  Bottom 0.254: v32.12,36.97 27.43,32.28 27.43,31.19 26.43,30.19 v26.43,29 | v51.07,16.87 46.02,16.87 40.48,22.41 34.2,22.41 v33.09,21.3
TCK  (via drill 0.61 pad 1.02)
  Top 0.254: IC2.67 51.98,38.77 v51.98,30.82 | v21.43,14 21.43,12.3 20.79,11.66 19.86,11.66 18.82,12.7 SV2.9 17.78,13.22 17.78,13.74 15.31,16.21 RN6.1
  Bottom 0.254: v21.43,14 36.31,28.89 41.22,28.89 42.9,30.57 49.01,30.57 49.39,30.95 51.86,30.95 v51.98,30.82
TDI  (via drill 0.61 pad 1.02)
  Top 0.254: IC2.63 49.97,37.74 49.77,37.54 v49.77,30.11 | RN6.3 16.91,18.99 17.63,18.99 22.86,13.76 22.86,13.74 SV2.5
  Bottom 0.254: v49.77,30.11 43.41,30.11 41.57,28.27 38.87,28.27 23.9,13.3 23.9,12.7 SV2.5
TDO  (via drill 0.61 pad 1.02)
  Top 0.254: v42.56,48.6 42.56,51.87 47.97,57.27 IC2.122
  Bottom 0.254: v42.56,48.6 42.56,44.71 41.31,43.46 38.67,43.46 35.37,40.15 35.37,37.47 30.91,33.01 30.91,32.25 21.1,22.45 20.9,22.45 19.24,20.78 19.24,12.26 19.84,11.66 24.36,11.66 SV2.3
TMS  (via drill 0.61 pad 1.02)
  Top 0.254: IC2.65 v50.97,40.67 | SV2.7 20.32,13.74 16.11,17.95 RN6.2
  Bottom 0.254: SV2.7 20.32,15.34 32.93,27.95 32.93,33.26 37.33,37.65 37.33,40.78 38.81,42.27 48.1,42.27 49.69,40.67 v50.97,40.67
UDQM
  Top 0.254: RN9.8 29.14,71.06 30.38,69.82 30.38,56.29 33.4,53.28 33.89,53.28 IC2.11
VCC-X
  Top 0.254: R8.1 68.6,6.35 68.6,5.62 68.45,5.47 67.09,5.47 66.9,5.66 66.9,9.35 | 66.9,9.35 67.75,10.2 IC10.P$4 | 66.9,9.35 63.85,9.35 63.5,9.7 C11.1

## Text on the board
tNames: A500-EXT-IDE v1.0 / (C) EmberHeavyIndustries 2019 / based on CDTV-IDE-RAM V0.6 / (C) Matthias Heinrichs 2016